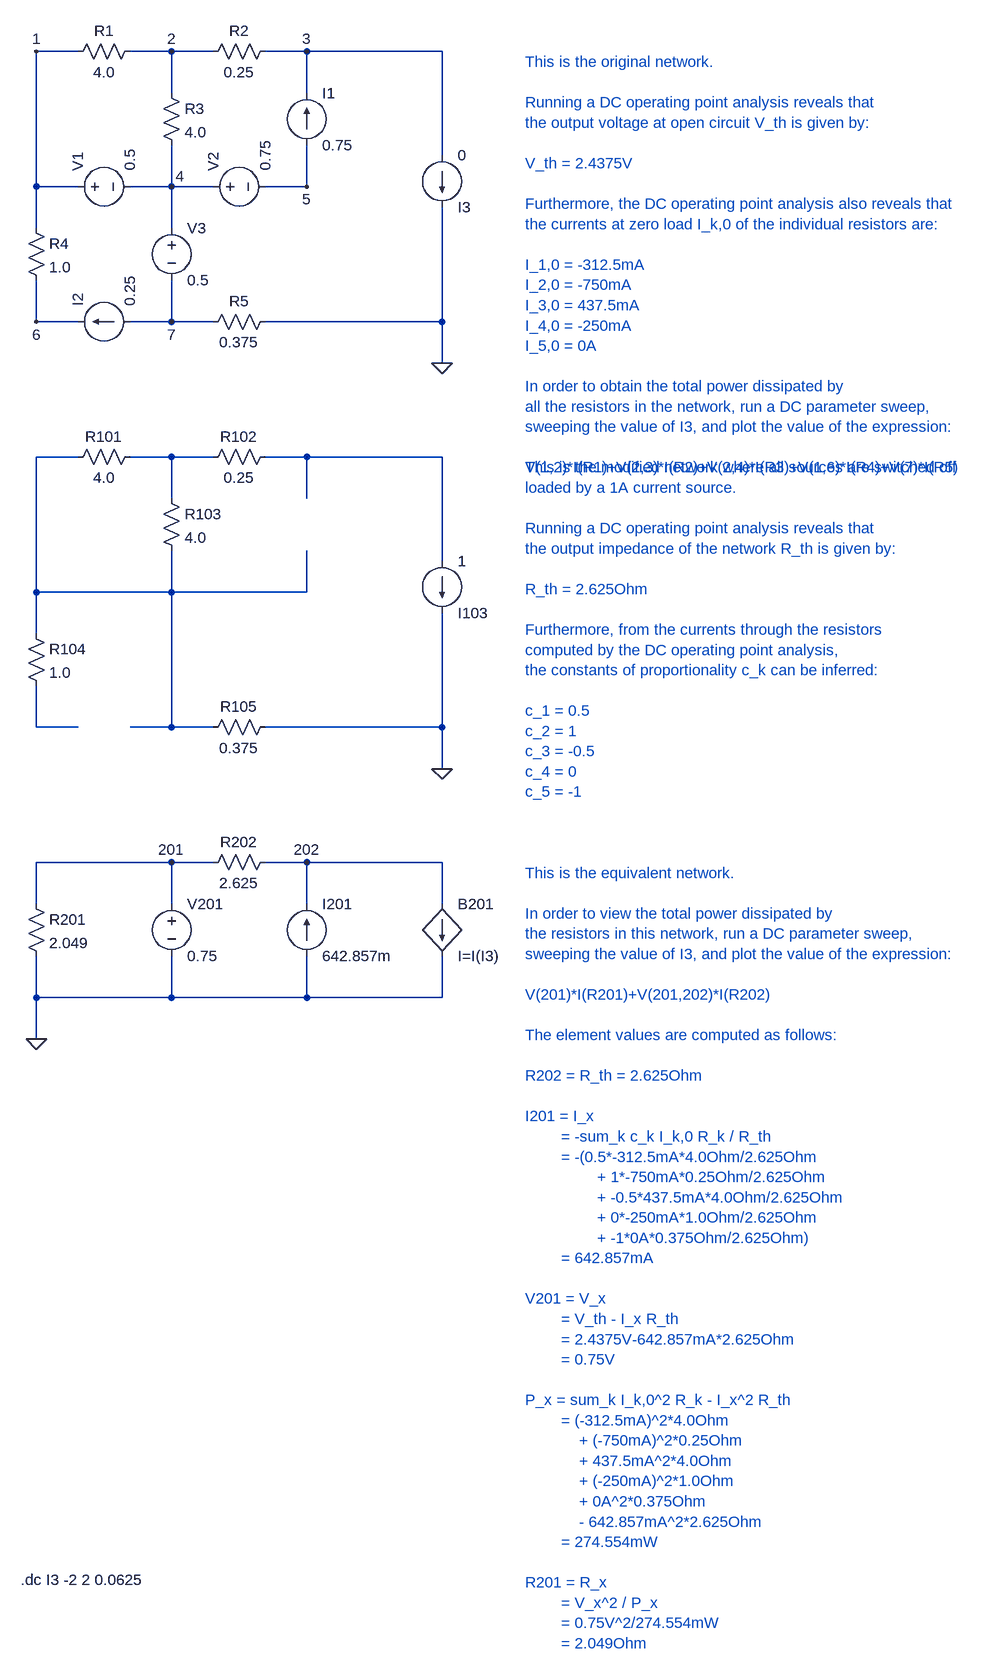
[diagram p0: schematic example.asc]
example.asc, the LTspice schematic file:
Version 4
SHEET 1 3096 3308
WIRE 64 0 0 0
WIRE 208 0 144 0
WIRE 272 0 208 0
WIRE 416 0 352 0
WIRE 624 0 416 0
WIRE 208 64 208 0
WIRE 416 64 416 0
WIRE 624 160 624 0
WIRE 0 208 0 0
WIRE 64 208 0 208
WIRE 208 208 208 144
WIRE 208 208 144 208
WIRE 272 208 208 208
WIRE 416 208 416 144
WIRE 416 208 352 208
WIRE 0 272 0 208
WIRE 208 272 208 208
WIRE 0 416 0 352
WIRE 64 416 0 416
WIRE 208 416 208 352
WIRE 208 416 144 416
WIRE 272 416 208 416
WIRE 624 416 624 240
WIRE 624 416 352 416
WIRE 624 480 624 416
WIRE 64 624 0 624
WIRE 208 624 144 624
WIRE 272 624 208 624
WIRE 416 624 352 624
WIRE 624 624 416 624
WIRE 208 688 208 624
WIRE 416 688 416 624
WIRE 624 784 624 624
WIRE 0 832 0 624
WIRE 208 832 208 768
WIRE 208 832 0 832
WIRE 416 832 416 768
WIRE 416 832 208 832
WIRE 0 896 0 832
WIRE 0 1040 0 976
WIRE 64 1040 0 1040
WIRE 208 1040 208 832
WIRE 208 1040 144 1040
WIRE 272 1040 208 1040
WIRE 624 1040 624 864
WIRE 624 1040 352 1040
WIRE 624 1104 624 1040
WIRE 208 1248 0 1248
WIRE 272 1248 208 1248
WIRE 416 1248 352 1248
WIRE 624 1248 416 1248
WIRE 0 1312 0 1248
WIRE 208 1312 208 1248
WIRE 416 1312 416 1248
WIRE 624 1312 624 1248
WIRE 0 1456 0 1392
WIRE 208 1456 208 1392
WIRE 208 1456 0 1456
WIRE 416 1456 416 1392
WIRE 416 1456 208 1456
WIRE 624 1456 624 1392
WIRE 624 1456 416 1456
WIRE 0 1520 0 1456
FLAG 624 480 0
FLAG 0 1520 0
FLAG 416 1248 202
FLAG 208 1248 201
FLAG 624 1104 0
FLAG 0 0 1
FLAG 208 0 2
FLAG 416 0 3
FLAG 208 208 4
FLAG 416 208 5
FLAG 0 416 6
FLAG 208 416 7
SYMBOL voltage 48 208 R270
WINDOW 123 0 0 Left 0
WINDOW 39 0 0 Left 0
SYMATTR InstName V1
SYMATTR Value 0.5
SYMBOL voltage 256 208 R270
WINDOW 123 0 0 Left 0
WINDOW 39 0 0 Left 0
SYMATTR InstName V2
SYMATTR Value 0.75
SYMBOL voltage 208 256 R0
WINDOW 123 0 0 Left 0
WINDOW 39 0 0 Left 0
SYMATTR InstName V3
SYMATTR Value 0.5
SYMBOL current 416 144 M180
WINDOW 0 24 80 Left 2
WINDOW 3 24 0 Left 2
WINDOW 123 0 0 Left 0
WINDOW 39 0 0 Left 0
SYMATTR InstName I1
SYMATTR Value 0.75
SYMBOL current 144 416 M270
WINDOW 0 24 80 Left 2
WINDOW 3 24 0 Left 2
WINDOW 123 0 0 Left 0
WINDOW 39 0 0 Left 0
SYMATTR InstName I2
SYMATTR Value 0.25
SYMBOL current 624 160 R0
WINDOW 0 24 80 Left 2
WINDOW 3 24 0 Left 2
WINDOW 123 0 0 Left 0
WINDOW 39 0 0 Left 0
SYMATTR InstName I3
SYMATTR Value 0
SYMBOL res 48 16 R270
WINDOW 0 32 56 VTop 2
WINDOW 3 0 56 VBottom 2
SYMATTR InstName R1
SYMATTR Value 4.0
SYMBOL res 256 16 R270
WINDOW 0 32 56 VTop 2
WINDOW 3 0 56 VBottom 2
SYMATTR InstName R2
SYMATTR Value 0.25
SYMBOL res 192 48 R0
SYMATTR InstName R3
SYMATTR Value 4.0
SYMBOL res -16 256 R0
SYMATTR InstName R4
SYMATTR Value 1.0
SYMBOL res 256 432 R270
WINDOW 0 32 56 VTop 2
WINDOW 3 0 56 VBottom 2
SYMATTR InstName R5
SYMATTR Value 0.375
SYMBOL res 256 1264 R270
WINDOW 0 32 56 VTop 2
WINDOW 3 0 56 VBottom 2
SYMATTR InstName R202
SYMATTR Value 2.625
SYMBOL res -16 1296 R0
SYMATTR InstName R201
SYMATTR Value 2.049
SYMBOL voltage 208 1296 R0
WINDOW 123 0 0 Left 0
WINDOW 39 0 0 Left 0
SYMATTR InstName V201
SYMATTR Value 0.75
SYMBOL current 416 1392 M180
WINDOW 0 24 80 Left 2
WINDOW 3 24 0 Left 2
WINDOW 123 0 0 Left 0
WINDOW 39 0 0 Left 0
SYMATTR InstName I201
SYMATTR Value 642.857m
SYMBOL bi 624 1312 R0
SYMATTR InstName B201
SYMATTR Value I=I(I3)
SYMBOL current 624 784 R0
WINDOW 0 24 80 Left 2
WINDOW 3 24 0 Left 2
WINDOW 123 0 0 Left 0
WINDOW 39 0 0 Left 0
SYMATTR InstName I103
SYMATTR Value 1
SYMBOL res 48 640 R270
WINDOW 0 32 56 VTop 2
WINDOW 3 0 56 VBottom 2
SYMATTR InstName R101
SYMATTR Value 4.0
SYMBOL res 256 640 R270
WINDOW 0 32 56 VTop 2
WINDOW 3 0 56 VBottom 2
SYMATTR InstName R102
SYMATTR Value 0.25
SYMBOL res 192 672 R0
SYMATTR InstName R103
SYMATTR Value 4.0
SYMBOL res -16 880 R0
SYMATTR InstName R104
SYMATTR Value 1.0
SYMBOL res 256 1056 R270
WINDOW 0 32 56 VTop 2
WINDOW 3 0 56 VBottom 2
SYMATTR InstName R105
SYMATTR Value 0.375
TEXT 752 640 Left 2 ;This is the modified network where all sources are switched off\nloaded by a 1A current source.\n \nRunning a DC operating point analysis reveals that\nthe output impedance of the network R_th is given by:\n \nR_th = 2.625Ohm\n \nFurthermore, from the currents through the resistors\ncomputed by the DC operating point analysis,\nthe constants of proportionality c_k can be inferred:\n \nc_1 = 0.5\nc_2 = 1\nc_3 = -0.5\nc_4 = 0\nc_5 = -1
TEXT 752 16 Left 2 ;This is the original network.\n \nRunning a DC operating point analysis reveals that\nthe output voltage at open circuit V_th is given by:\n \nV_th = 2.4375V\n \nFurthermore, the DC operating point analysis also reveals that\nthe currents at zero load I_k,0 of the individual resistors are:\n \nI_1,0 = -312.5mA\nI_2,0 = -750mA\nI_3,0 = 437.5mA\nI_4,0 = -250mA\nI_5,0 = 0A\n \nIn order to obtain the total power dissipated by\nall the resistors in the network, run a DC parameter sweep,\nsweeping the value of I3, and plot the value of the expression:\n \nV(1,2)*I(R1)+V(2,3)*I(R2)+V(2,4)*I(R3)+V(1,6)*I(R4)+V(7)*I(R5)
TEXT 752 1264 Left 2 ;This is the equivalent network.\n \nIn order to view the total power dissipated by\nthe resistors in this network, run a DC parameter sweep,\nsweeping the value of I3, and plot the value of the expression:\n \nV(201)*I(R201)+V(201,202)*I(R202)\n \nThe element values are computed as follows:\n \nR202 = R_th = 2.625Ohm\n \nI201 = I_x\n        = -sum_k c_k I_k,0 R_k / R_th\n        = -(0.5*-312.5mA*4.0Ohm/2.625Ohm\n                + 1*-750mA*0.25Ohm/2.625Ohm\n                + -0.5*437.5mA*4.0Ohm/2.625Ohm\n                + 0*-250mA*1.0Ohm/2.625Ohm\n                + -1*0A*0.375Ohm/2.625Ohm)\n        = 642.857mA\n \nV201 = V_x\n        = V_th - I_x R_th\n        = 2.4375V-642.857mA*2.625Ohm\n        = 0.75V\n \nP_x = sum_k I_k,0^2 R_k - I_x^2 R_th\n        = (-312.5mA)^2*4.0Ohm\n            + (-750mA)^2*0.25Ohm\n            + 437.5mA^2*4.0Ohm\n            + (-250mA)^2*1.0Ohm\n            + 0A^2*0.375Ohm\n            - 642.857mA^2*2.625Ohm\n        = 274.554mW\n \nR201 = R_x\n        = V_x^2 / P_x\n        = 0.75V^2/274.554mW\n        = 2.049Ohm
TEXT -24 2352 Left 2 !.dc I3 -2 2 0.0625

The netlist it stands for:
* example.asc
V1 1 4 0.5
V2 4 5 0.75
V3 4 7 0.5
I1 5 3 0.75
I2 7 6 0.25
I3 3 0 0
R1 1 2 4.0
R2 2 3 0.25
R3 2 4 4.0
R4 1 6 1.0
R5 7 0 0.375
R202 201 202 2.625
R201 201 0 2.049
V201 201 0 0.75
I201 0 202 642.857m
B201 202 0 I=I(I3)
I103 N003 0 1
R101 N001 N002 4.0
R102 N002 N003 0.25
R103 N002 N001 4.0
R104 N001 N004 1.0
R105 N001 0 0.375
* This is the modified network where all sources are switched off
* loaded by a 1A current source.
* Running a DC operating point analysis reveals that
* the output impedance of the network R_th is given by:
* R_th = 2.625Ohm
* Furthermore, from the currents through the resistors
* computed by the DC operating point analysis,
* the constants of proportionality c_k can be inferred:
* c_1 = 0.5
* c_2 = 1
* c_3 = -0.5
* c_4 = 0
* c_5 = -1
* This is the original network.
* Running a DC operating point analysis reveals that
* the output voltage at open circuit V_th is given by:
* V_th = 2.4375V
* Furthermore, the DC operating point analysis also reveals that
* the currents at zero load I_k,0 of the individual resistors are:
* I_1,0 = -312.5mA
* I_2,0 = -750mA
* I_3,0 = 437.5mA
* I_4,0 = -250mA
* I_5,0 = 0A
* In order to obtain the total power dissipated by
* all the resistors in the network, run a DC parameter sweep,
* sweeping the value of I3, and plot the value of the expression:
* V(1,2)*I(R1)+V(2,3)*I(R2)+V(2,4)*I(R3)+V(1,6)*I(R4)+V(7)*I(R5)
* This is the equivalent network.
* In order to view the total power dissipated by
* the resistors in this network, run a DC parameter sweep,
* sweeping the value of I3, and plot the value of the expression:
* V(201)*I(R201)+V(201,202)*I(R202)
* The element values are computed as follows:
* R202 = R_th = 2.625Ohm
* I201 = I_x
*         = -sum_k c_k I_k,0 R_k / R_th
*         = -(0.5*-312.5mA*4.0Ohm/2.625Ohm
*                 + 1*-750mA*0.25Ohm/2.625Ohm
*                 + -0.5*437.5mA*4.0Ohm/2.625Ohm
*                 + 0*-250mA*1.0Ohm/2.625Ohm
*                 + -1*0A*0.375Ohm/2.625Ohm)
*         = 642.857mA
* V201 = V_x
*         = V_th - I_x R_th
*         = 2.4375V-642.857mA*2.625Ohm
*         = 0.75V
* P_x = sum_k I_k,0^2 R_k - I_x^2 R_th
*         = (-312.5mA)^2*4.0Ohm
*             + (-750mA)^2*0.25Ohm
*             + 437.5mA^2*4.0Ohm
*             + (-250mA)^2*1.0Ohm
*             + 0A^2*0.375Ohm
*             - 642.857mA^2*2.625Ohm
*         = 274.554mW
* R201 = R_x
*         = V_x^2 / P_x
*         = 0.75V^2/274.554mW
*         = 2.049Ohm
.dc I3 -2 2 0.0625
.backanno
.end